# Altium project GN-1846-E-V2_HI3531A.PRJPCB (part 4 of 5)

## Sheet P05 Power Supply2.SchDoc
size 420 x 297 mm
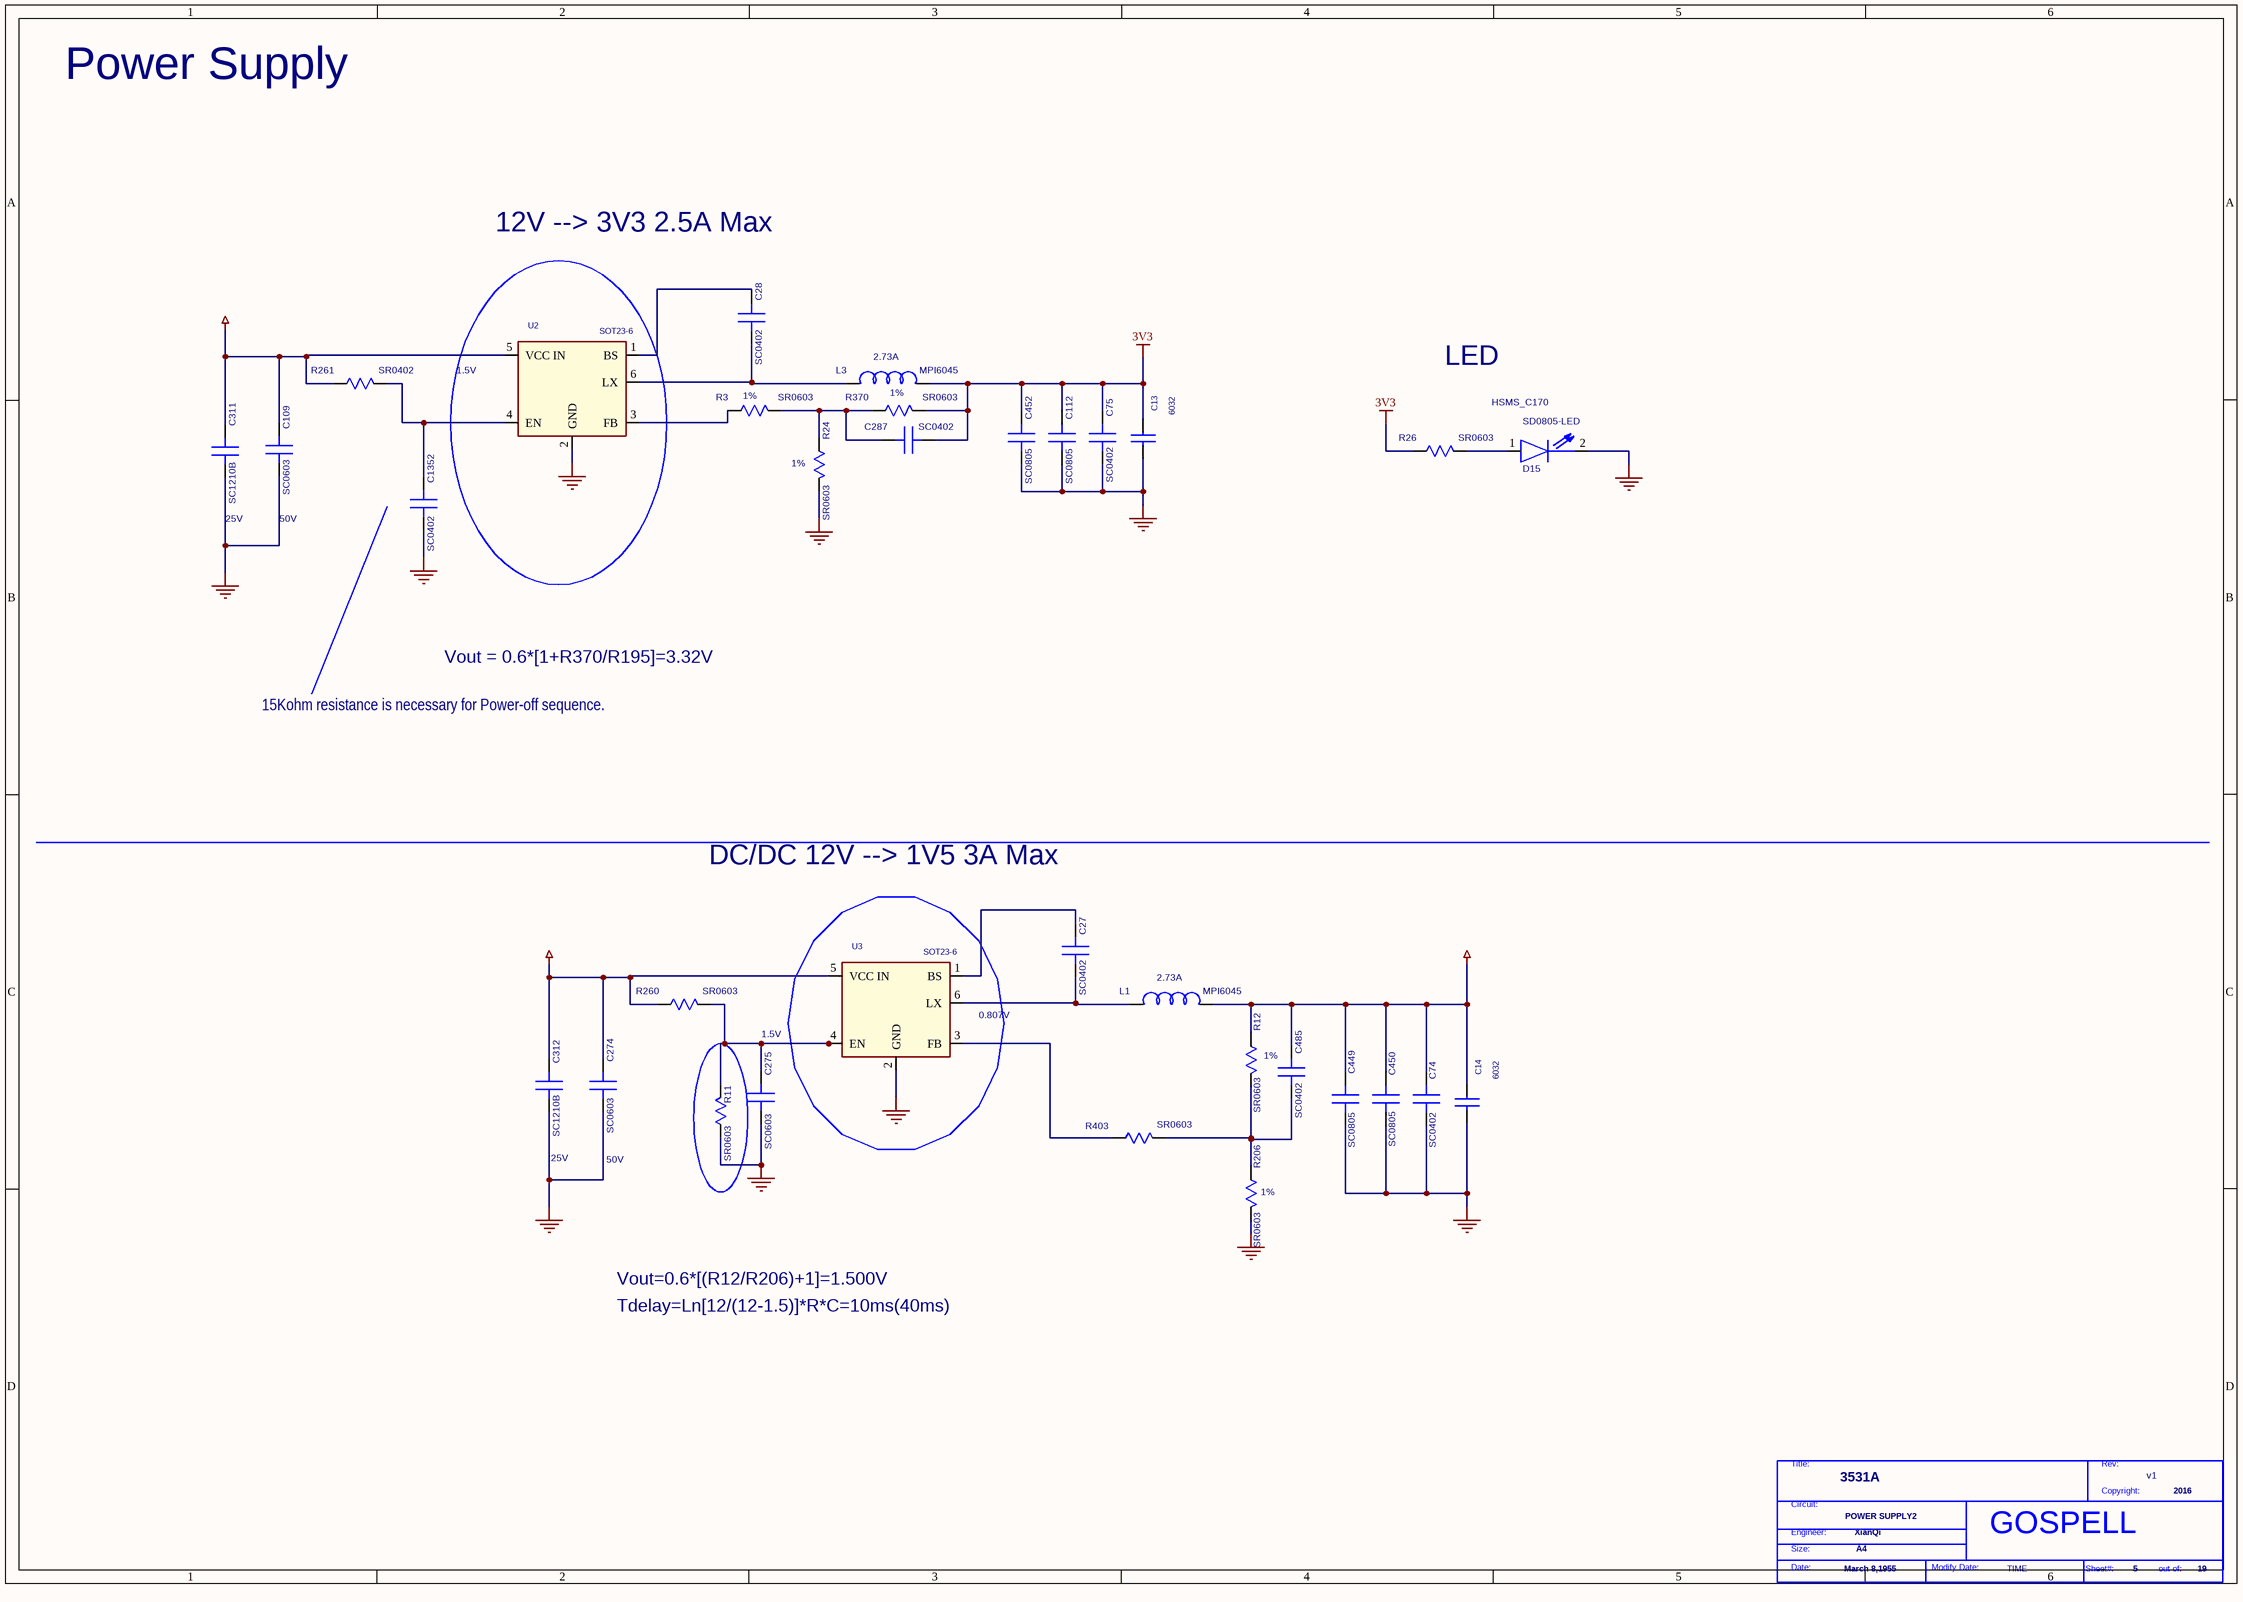
[diagram p13: P05 Power Supply2.SchDoc]

### Parts
(Parts that share a designator on the sheet are numbered #1, #2 ... from top to bottom, then left to right.)
*#14  Page Modify Date: TIME  Engineer: XianQi  Copyright: 2016  Title: 3531A  RevCode: v1  Page Size: A4  Page Create Date: March 8,1955  Page Number: 5  Page Count: 19  Doc: POWER SUPPLY2  (hidden comment: GOSPELL)  (graphical)
C13  6032  [6032]
C14  6032  [6032]
C27  SC0402  [SC0402]
C28  SC0402  [SC0402]
C74  SC0402  [SC0402]
C75  SC0402  [SC0402]
C109  SC0603  [SC0603]
C112  SC0805  [SC0805]
C274  SC0603  [SC0603]
C275  SC0603  [SC0603]
C287  SC0402  [SC0402]
C311  SC1210B  [SC1210B]
C312  SC1210B  [SC1210B]
C449  SC0805  [SC0805]
C450  SC0805  [SC0805]
C452  SC0805  [SC0805]
C485  SC0402  [SC0402]
C1352  SC0402  [SC0402]
D15  SD0805-LED  DEVICE: HSMS_C170  [SD0805-LED]
L1  MPI6045  [MPI6045]
L3  MPI6045  [MPI6045]
R3  SR0603  [SR0603]
R11  SR0603  [SR0603]
R12  SR0603  [SR0603]
R24  SR0603  [SR0603]
R26  SR0603  [SR0603]
R206  SR0603  [SR0603]
R260  SR0603  [SR0603]
R261  SR0402  [SR0402]
R370  SR0603  [SR0603]
R403  SR0603  [SR0603]
U2  SOT23-6  [SOT23-6]
U3  SOT23-6  [SOT23-6]

### Nets
1V5: C14.1 C74.1(A) C449.1(A) C450.1(A) C485.1(A) L1.2(B) R12.1(A)
3V3: C13.1 C75.1(A) C112.1(A) C287.2(B) C452.1(A) L3.2(B) R26.1(A) R370.2(B)
12V0: C109.1(A) C274.1(A) C311.1(A) C312.1(A) R260.1(A) R261.1(A) U2.5(VCC_IN) U3.5(VCC_IN)
GND: C13.2 C14.2 C74.2(B) C75.2(B) C109.2(B) C112.2(B) C274.2(B) C275.2(B) C311.2(B) C312.2(B) C449.2(B) C450.2(B) C452.2(B) C1352.2(B) D15.2(B) R11.1(A) R24.2(B) R206.2(B) U2.2(GND) U3.2(GND)
NetC27_1: C27.1(A) U3.1(BS)
NetC27_2: C27.2(B) L1.1(A) U3.6(LX)
NetC28_1: C28.1(A) U2.1(BS)
NetC28_2: C28.2(B) L3.1(A) U2.6(LX)
NetC275_1: C275.1(A) R11.2(B) R260.2(B) U3.4(EN)
NetC287_1: C287.1(A) R3.2(B) R24.1(A) R370.1(A)
NetC485_2: C485.2(B) R12.2(B) R206.1(A) R403.2(B)
NetC1352_1: C1352.1(A) R261.2(B) U2.4(EN)
NetD15_1: D15.1(A) R26.2(B)
NetR3_1: R3.1(A) U2.3(FB)
NetR403_1: R403.1(A) U3.3(FB)

### Notes on the sheet
- Power Supply
- 12V --> 3V3 2.5A Max
- (near U2) 1.5V
- (near R3) 1%
- (near L3) 2.73A
- 1%
- LED
- 25V
- 50V
- (near R24) 1%
- Vout = 0.6*[1+R370/R195]=3.32V
- 15Kohm resistance is necessary for Power-off sequence.
- DC/DC 12V --> 1V5 3A Max
- (near L1) 2.73A
- 1.5V
- (near U3) 0.807V
- (near R206) 1%
- Tdelay=Ln[12/(12-1.5)]*R*C=10ms(40ms)
- Vout=0.6*[(R12/R206)+1]=1.500V
- (in symbol GOSPELL) Title:; Rev:; Copyright:; Circuit:; Engineer:; Size:; Date:; Modify Date:; Sheet#:; out of:

### Library data of the parts
C13 C14 = CAP NP
C27 C28 = C_0_Dup2: PARTS: 1; PINSWAP: (A,B); LEVEL: STD; DEVICE: RMEMK105BJ104KV_FR; OriginalSymbolOrigin: (0,30); CODE: 8070614; %195%%232%%202%%246%: SMD陶瓷电容-16V-100NF-+/-10%-X7R-0402-BT; %182%%238%%182%%168%%185%%164%%215%%247%%181%%231%%209%%185%(V): 16; COMPONENT_HIGH_MAX: 0.55MM; %208%%161%%192%%224%%195%%251%%179%%198%: SMD陶瓷电容; PKG_TYPE: SC0402
C74 = C_0_Dup2: PARTS: 1; PINSWAP: (A,B); LEVEL: STD; DEVICE: RMEMK105BJ104KV_FR; OriginalSymbolOrigin: (0,30); %208%%161%%192%%224%%195%%251%%179%%198%: SMD陶瓷电容; COMPONENT_HIGH_MAX: 0.6MM; %182%%238%%182%%168%%185%%164%%215%%247%%181%%231%%209%%185%(V): 16; %195%%232%%202%%246%: SMD陶瓷电容-16V-100NF-+/-10%-X7R-0402-BT; CODE: 8070614; PKG_TYPE: SC0402
C75 = C_0_Dup2: PARTS: 1; PINSWAP: (A,B); LEVEL: STD; DEVICE: RMEMK105BJ104KV_FR; OriginalSymbolOrigin: (0,30); CODE: 8070614; %195%%232%%202%%246%: SMD陶瓷电容-16V-100NF-+/-10%-X7R-0402-BT; %182%%238%%182%%168%%185%%164%%215%%247%%181%%231%%209%%185%(V): 16; COMPONENT_HIGH_MAX: 0.6MM; %208%%161%%192%%224%%195%%251%%179%%198%: SMD陶瓷电容; PKG_TYPE: SC0402
C109 C274 = C_0_Dup2: PARTS: 1; PINSWAP: (A,B); LEVEL: STD; DEVICE: C1608X7R1H104KT000N; OriginalSymbolOrigin: (0,30); %208%%161%%192%%224%%195%%251%%179%%198%: SMD陶瓷电容; COMPONENT_HIGH_MAX: 0.9MM; %182%%238%%182%%168%%185%%164%%215%%247%%181%%231%%209%%185%(V): 50; %195%%232%%202%%246%: SMD陶瓷电容-50V-100NF-+/-10%-X7R-0603; CODE: 8070627; PKG_TYPE: SC0603
C112 C449 C450 = C_0_Dup2: PARTS: 1; PINSWAP: (A,B); LEVEL: STD; DEVICE: C2012X5R0J226MT000N; OriginalSymbolOrigin: (0,30); %208%%161%%192%%224%%195%%251%%179%%198%: SMD陶瓷电容; COMPONENT_HIGH_MAX: 1.35MM; %182%%238%%182%%168%%185%%164%%215%%247%%181%%231%%209%%185%(V): 6.3; %195%%232%%202%%246%: SMD陶瓷电容-6.3V-22000NF-+/-20%-X5R-0805-08070784编码拆分供华为技术使用; CODE: 8071114; PKG_TYPE: SC0805
C275 = C_0_Dup2: PARTS: 1; PINSWAP: (A,B); LEVEL: STD; DEVICE: CV05X5R105K10AH; OriginalSymbolOrigin: (0,30); %208%%161%%192%%224%%195%%251%%179%%198%: SMD陶瓷电容; COMPONENT_HIGH_MAX: 0.55MM; %182%%238%%182%%168%%185%%164%%215%%247%%181%%231%%209%%185%(V): 10; %195%%232%%202%%246%: SMD陶瓷电容-10V-1000NF-+/-10%-X5R-0402-BT,TS16949; CODE: 8070612; PKG_TYPE: SC0603
C287 = C_0_Dup2: PARTS: 1; PINSWAP: (A,B); LEVEL: STD; DEVICE: C0402C150J5GAC_7867; OriginalSymbolOrigin: (0,30); CODE: 8070544; %195%%232%%202%%246%: SMD陶瓷电容-50V-0.015NF-+/-5%-NP0-0402; %182%%238%%182%%168%%185%%164%%215%%247%%181%%231%%209%%185%(V): 50; COMPONENT_HIGH_MAX: 0.55MM; %208%%161%%192%%224%%195%%251%%179%%198%: SMD陶瓷电容; PKG_TYPE: SC0402
C311 = C_0_Dup2: PARTS: 1; PINSWAP: (A,B); LEVEL: STD; DEVICE: CETMK325B7226KM_T; OriginalSymbolOrigin: (0,30); %208%%161%%192%%224%%195%%251%%179%%198%: SMD陶瓷电容; COMPONENT_HIGH_MAX: 2.7MM; %182%%238%%182%%168%%185%%164%%215%%247%%181%%231%%209%%185%(V): 25; %195%%232%%202%%246%: SMD陶瓷电容-25V-22000NF-+/-10%-X7R-1210-所有; CODE: 8070825; PKG_TYPE: SC1210B
C312 = C_0_Dup2: PARTS: 1; PINSWAP: (A,B); LEVEL: STD; DEVICE: CETMK325B7226KM_T; OriginalSymbolOrigin: (0,30); CODE: 8070825; %195%%232%%202%%246%: SMD陶瓷电容-25V-22000NF-+/-10%-X7R-1210-所有; %182%%238%%182%%168%%185%%164%%215%%247%%181%%231%%209%%185%(V): 25; COMPONENT_HIGH_MAX: 2.7MM; %208%%161%%192%%224%%195%%251%%179%%198%: SMD陶瓷电容; PKG_TYPE: SC1210B
C452 = C_0_Dup2: PARTS: 1; PINSWAP: (A,B); LEVEL: STD; DEVICE: C2012X5R0J226MT000N; OriginalSymbolOrigin: (0,30); CODE: 8071114; %195%%232%%202%%246%: SMD陶瓷电容-6.3V-22000NF-+/-20%-X5R-0805-08070784编码拆分供华为技术使用; %182%%238%%182%%168%%185%%164%%215%%247%%181%%231%%209%%185%(V): 6.3; COMPONENT_HIGH_MAX: 1.35MM; %208%%161%%192%%224%%195%%251%%179%%198%: SMD陶瓷电容; PKG_TYPE: SC0805
C485 = C_0_Dup2: PARTS: 1; PINSWAP: (A,B); LEVEL: STD; DEVICE: C0402C150J5GAC_7867; OriginalSymbolOrigin: (0,30); %208%%161%%192%%224%%195%%251%%179%%198%: SMD陶瓷电容; COMPONENT_HIGH_MAX: 0.55MM; %182%%238%%182%%168%%185%%164%%215%%247%%181%%231%%209%%185%(V): 50; %195%%232%%202%%246%: SMD陶瓷电容-50V-0.015NF-+/-5%-NP0-0402; CODE: 8070544; PKG_TYPE: SC0402
C1352 = C_0_Dup2: PARTS: 1; PINSWAP: (A,B); LEVEL: STD; DEVICE: RK73B1ETTP273J; OriginalSymbolOrigin: (0,30); %208%%161%%192%%224%%195%%251%%179%%198%: 片式厚膜电阻器; COMPONENT_HIGH_MAX: 0.4MM; %182%%238%%182%%168%%185%%164%%215%%247%%181%%231%%209%%185%(V): 10; %195%%232%%202%%246%: 片式厚膜电阻器-0.0625W-27000OHM-+/-5%-0402; CODE: 07090852; PKG_TYPE: SC0402
D15 = LED_1: PARTS: 1; LEVEL: STD; CODE: 15020062; OriginalSymbolOrigin: (10,20); %195%%232%%202%%246%: 发光二极管-0.015CD-红色/630NM-15MA-0805; COMPONENT_HIGH_MAX: 1.1MM; %208%%161%%192%%224%%195%%251%%179%%198%: 发光二极管; PKG_TYPE: SD0805-LED
L1 L3 = L_0_Dup1: PARTS: 1; DEVICE: LMNRS5040T4R7NMGK; LEVEL: STD; PKG_TYPE: SPL0505H; OriginalSymbolOrigin: (20,20); COMPONENT_HIGH_MAX: 4.1MM; %195%%232%%202%%246%: 功率电感-4.7UH-+/-30%-2.73A-0.039OHM-5.0*5.0*4.1MM-SMT-3.18A-00821851; CODE: 10100577
R3 = R_1: PARTS: 1; LEVEL: STD; DEVICE: RK73H1JTTD3012F; PINSWAP: (A,B); OriginalSymbolOrigin: (10,20); %208%%161%%192%%224%%195%%251%%179%%198%: 片式厚膜电阻器; COMPONENT_HIGH_MAX: 0.55MM; %215%%232%%214%%181%%212%%202%%208%%237%%198%%171%%178%%238%: +/-1%; %182%%238%%182%%168%%185%%166%%194%%202%(W): 0.1; %195%%232%%202%%246%: 片式厚膜电阻器-0.1W-30100OHM-+/-1%-0603; CODE: 7090531; PKG_TYPE: SR0603
R11 = R_1: PARTS: 1; LEVEL: STD; DEVICE: RC_02W3923FT; PINSWAP: (A,B); OriginalSymbolOrigin: (10,20); CODE: 7091395; %195%%232%%202%%246%: 片式厚膜电阻器-0.0625W-392000OHM-+/-1%-0402; %182%%238%%182%%168%%185%%166%%194%%202%(W): 0.06; %215%%232%%214%%181%%212%%202%%208%%237%%198%%171%%178%%238%: +/-1%; COMPONENT_HIGH_MAX: 0.4MM; %208%%161%%192%%224%%195%%251%%179%%198%: 片式厚膜电阻器; PKG_TYPE: SR0603
R12 = R_1: PARTS: 1; LEVEL: STD; DEVICE: RHS_03K2322FT; PINSWAP: (A,B); OriginalSymbolOrigin: (10,20); %208%%161%%192%%224%%195%%251%%179%%198%: 片式厚膜电阻器; COMPONENT_HIGH_MAX: 0.55MM; %215%%232%%214%%181%%212%%202%%208%%237%%198%%171%%178%%238%: +/-1%; %182%%238%%182%%168%%185%%166%%194%%202%(W): 0.1; %195%%232%%202%%246%: 片式厚膜电阻器-0.1W-23200OHM-+/-1%-0603; CODE: 7090706; PKG_TYPE: SR0603
R24 = R_1: PARTS: 1; LEVEL: STD; DEVICE: RHS_03K1802FT; PINSWAP: (A,B); OriginalSymbolOrigin: (10,20); CODE: 7090982; %195%%232%%202%%246%: 片式厚膜电阻器-0.1W-18000OHM-+/-1%-0603; %182%%238%%182%%168%%185%%166%%194%%202%(W): 0.1; %215%%232%%214%%181%%212%%202%%208%%237%%198%%171%%178%%238%: +/-1%; COMPONENT_HIGH_MAX: 0.55MM; %208%%161%%192%%224%%195%%251%%179%%198%: 片式厚膜电阻器; PKG_TYPE: SR0603
R26 = R_1: PARTS: 1; LEVEL: STD; DEVICE: RC0603FR_07499R; PINSWAP: (A,B); OriginalSymbolOrigin: (10,20); CODE: 7090676; %195%%232%%202%%246%: 片式厚膜电阻器-0.1W-499OHM-+/-1%-0603; %182%%238%%182%%168%%185%%166%%194%%202%(W): 0.1; %215%%232%%214%%181%%212%%202%%208%%237%%198%%171%%178%%238%: +/-1%; COMPONENT_HIGH_MAX: 0.55MM; %208%%161%%192%%224%%195%%251%%179%%198%: 片式厚膜电阻器; PKG_TYPE: SR0603
R206 = R_1: PARTS: 1; LEVEL: STD; DEVICE: RK73H1JTTD2702F; PINSWAP: (A,B); OriginalSymbolOrigin: (10,20); %208%%161%%192%%224%%195%%251%%179%%198%: 片式厚膜电阻器; COMPONENT_HIGH_MAX: 0.55MM; %215%%232%%214%%181%%212%%202%%208%%237%%198%%171%%178%%238%: +/-1%; %182%%238%%182%%168%%185%%166%%194%%202%(W): 0.1; %195%%232%%202%%246%: 片式厚膜电阻器-0.1W-27000OHM-+/-1%-0603; CODE: 7090937; PKG_TYPE: SR0603
R260 = R_1: PARTS: 1; LEVEL: STD; DEVICE: RC_02W3923FT; PINSWAP: (A,B); OriginalSymbolOrigin: (10,20); %208%%161%%192%%224%%195%%251%%179%%198%: 片式厚膜电阻器; COMPONENT_HIGH_MAX: 0.4MM; %215%%232%%214%%181%%212%%202%%208%%237%%198%%171%%178%%238%: +/-1%; %182%%238%%182%%168%%185%%166%%194%%202%(W): 0.06; %195%%232%%202%%246%: 片式厚膜电阻器-0.0625W-392000OHM-+/-1%-0402; CODE: 7091395; PKG_TYPE: SR0603
R261 = R_1: PARTS: 1; LEVEL: STD; DEVICE: RK73H1ETTP1003F; PINSWAP: (A,B); OriginalSymbolOrigin: (10,20); CODE: 7090875; %195%%232%%202%%246%: 片式厚膜电阻器-0.0625W-100000OHM-+/-1%-0402; %182%%238%%182%%168%%185%%166%%194%%202%(W): 0.06; %215%%232%%214%%181%%212%%202%%208%%237%%198%%171%%178%%238%: +/-1%; COMPONENT_HIGH_MAX: 0.4MM; %208%%161%%192%%224%%195%%251%%179%%198%: 片式厚膜电阻器; PKG_TYPE: SR0402
R370 = R_1: PARTS: 1; LEVEL: STD; DEVICE: RHS_03K5622FT; PINSWAP: (A,B); OriginalSymbolOrigin: (10,20); CODE: 7090933; %195%%232%%202%%246%: 片式厚膜电阻器-0.1W-56200OHM-+/-1%-0603; %182%%238%%182%%168%%185%%166%%194%%202%(W): 0.1; %215%%232%%214%%181%%212%%202%%208%%237%%198%%171%%178%%238%: +/-1%; COMPONENT_HIGH_MAX: 0.55MM; %208%%161%%192%%224%%195%%251%%179%%198%: 片式厚膜电阻器; PKG_TYPE: SR0603
R403 = R_1: PARTS: 1; LEVEL: STD; DEVICE: RK73H1JTTD7502F; PINSWAP: (A,B); OriginalSymbolOrigin: (10,20); CODE: 7091238; %195%%232%%202%%246%: 片式厚膜电阻器-0.1W-75000OHM-+/-1%-0603; %182%%238%%182%%168%%185%%166%%194%%202%(W): 0.1; %215%%232%%214%%181%%212%%202%%208%%237%%198%%171%%178%%238%: +/-1%; COMPONENT_HIGH_MAX: 0.55MM; %208%%161%%192%%224%%195%%251%%179%%198%: 片式厚膜电阻器; PKG_TYPE: SR0603
U2 U3 = SY8120

## Sheet P04 Power Supply1.SchDoc
size 420 x 297 mm
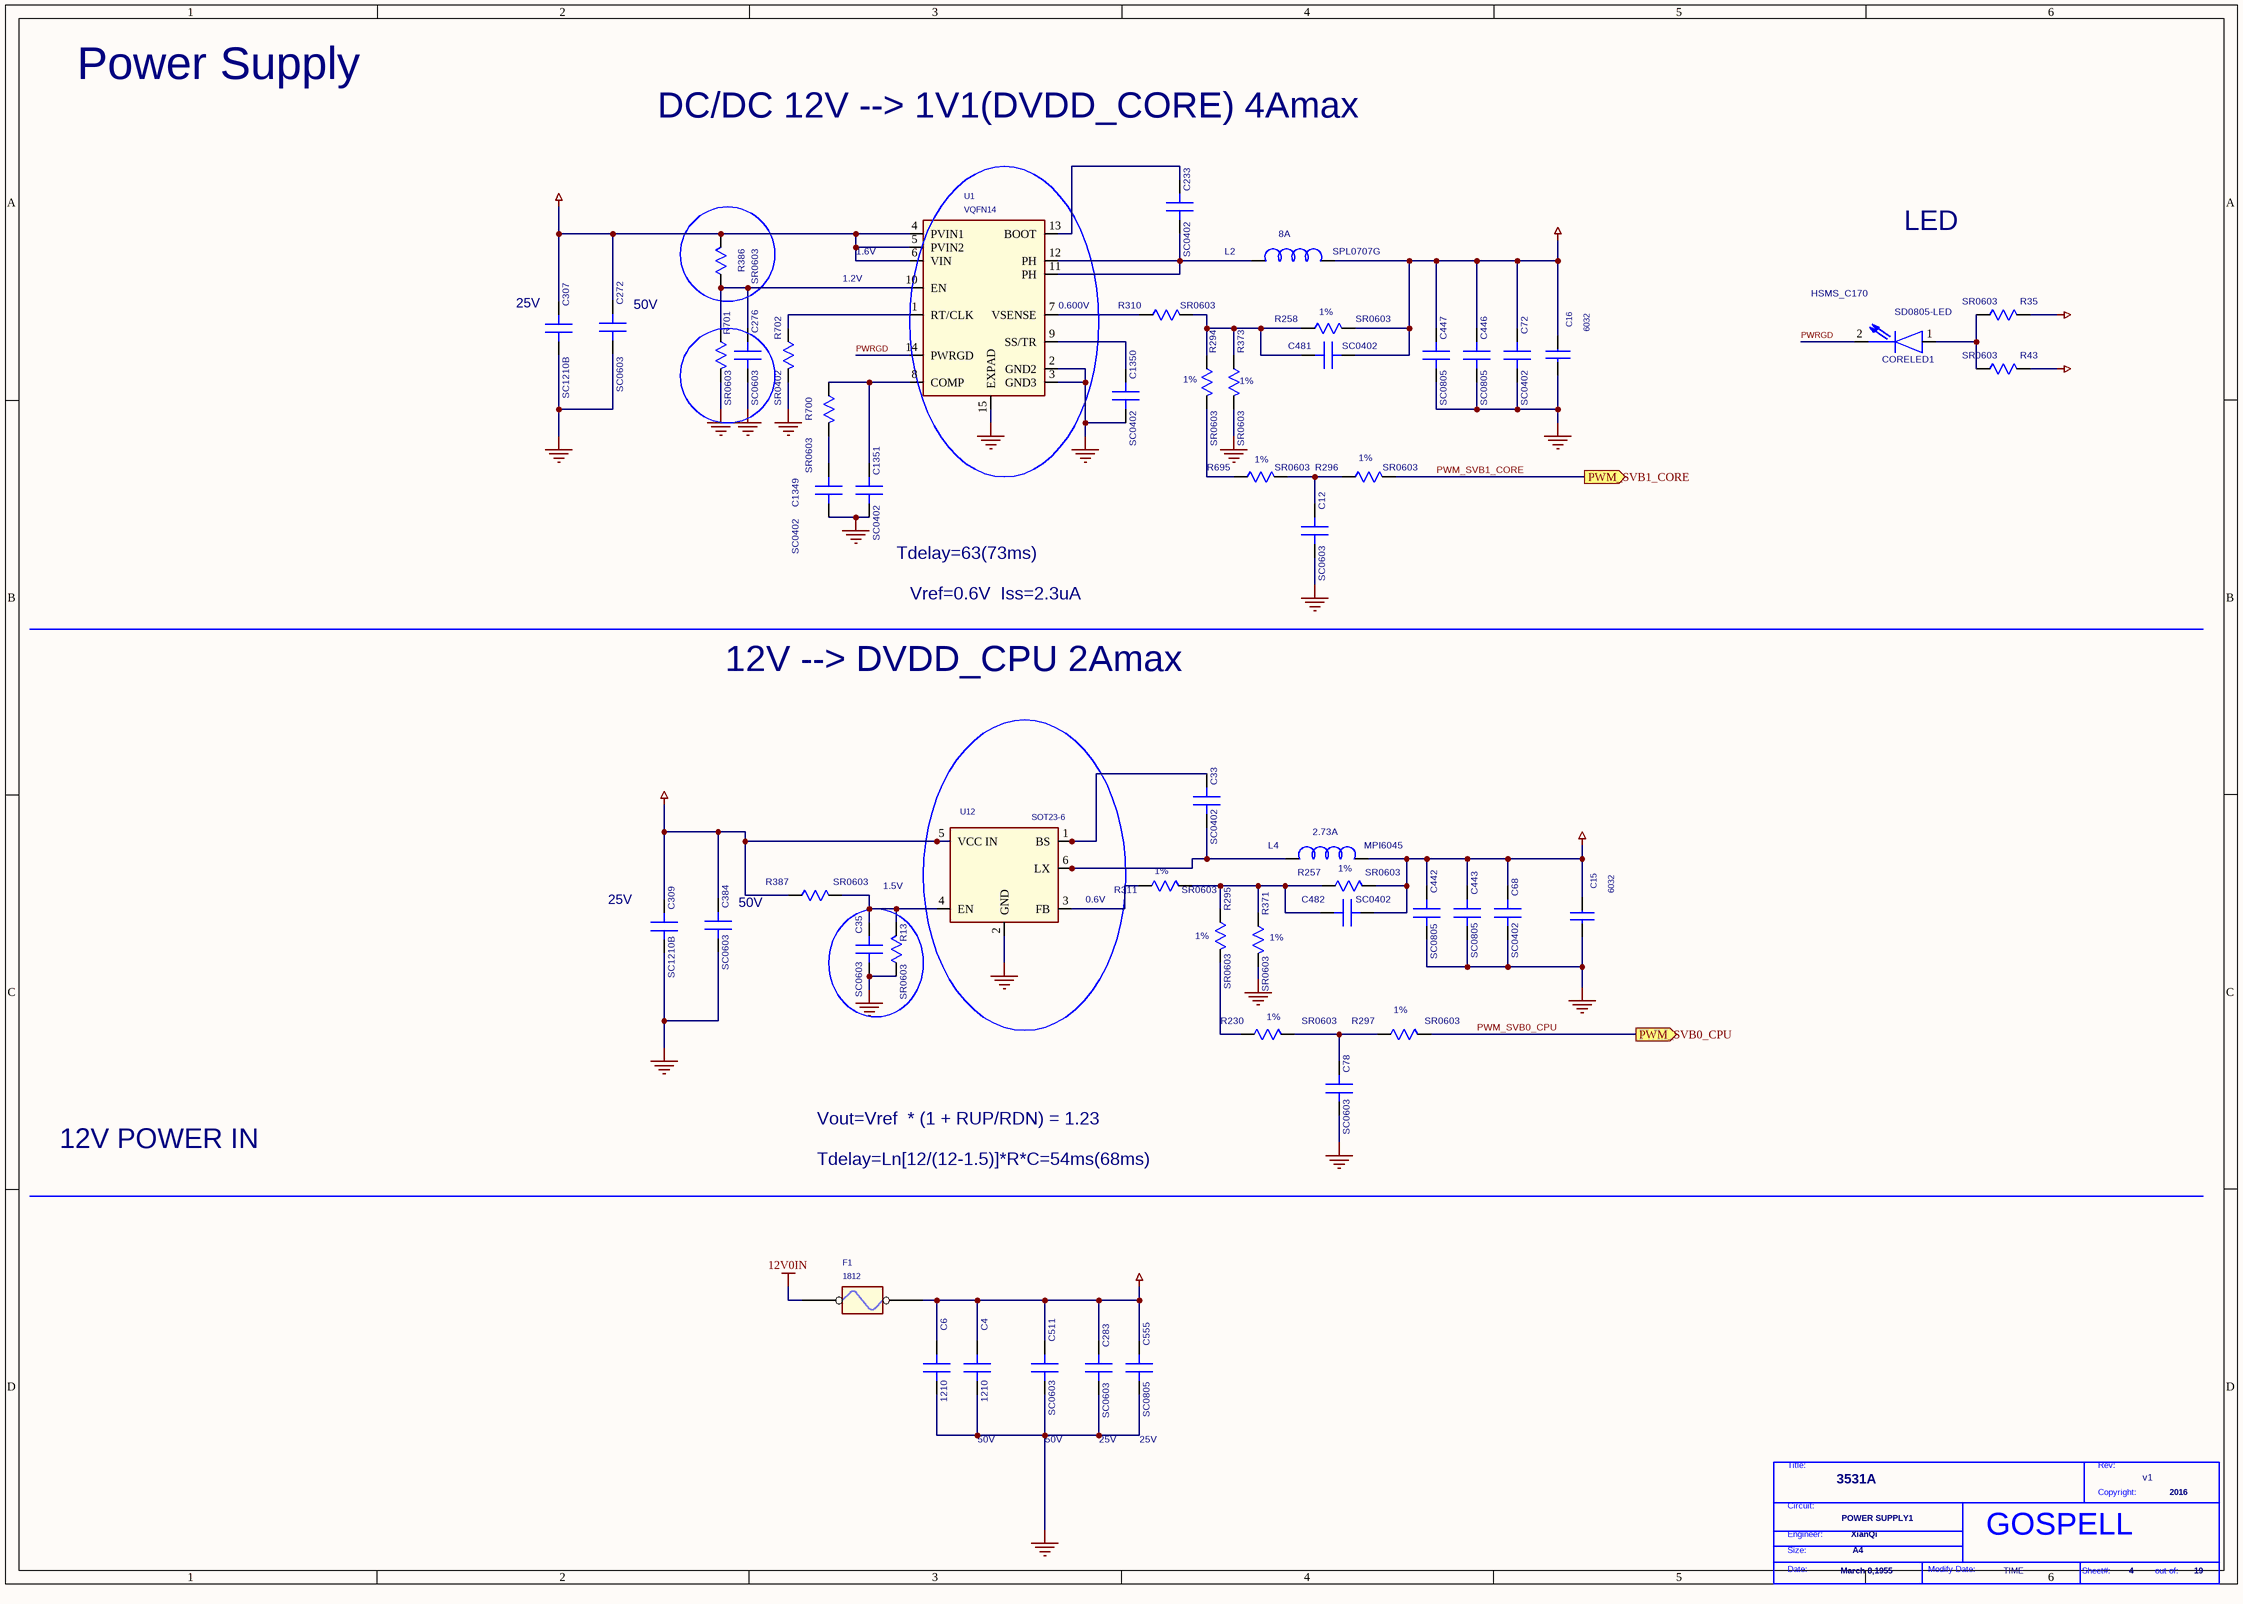
[diagram p14: P04 Power Supply1.SchDoc]

### Parts
(Parts that share a designator on the sheet are numbered #1, #2 ... from top to bottom, then left to right.)
*#15  Page Modify Date: TIME  Engineer: XianQi  Copyright: 2016  Title: 3531A  RevCode: v1  Page Size: A4  Page Create Date: March 8,1955  Page Number: 4  Page Count: 19  Doc: POWER SUPPLY1  (hidden comment: GOSPELL)  (graphical)
C4  1210  [1210]
C6  1210  [1210]
C12  SC0603  [SC0603]
C15  6032  [6032]
C16  6032  [6032]
C33  SC0402  [SC0402]
C35  SC0603  [SC0603]
C68  SC0402  [SC0402]
C72  SC0402  [SC0402]
C78  SC0603  [SC0603]
C233  SC0402  [SC0402]
C272  SC0603  [SC0603]
C276  SC0603  [SC0603]
C283  SC0603  [SC0603]
C307  SC1210B  [SC1210B]
C309  SC1210B  [SC1210B]
C384  SC0603  [SC0603]
C442  SC0805  [SC0805]
C443  SC0805  [SC0805]
C446  SC0805  [SC0805]
C447  SC0805  [SC0805]
C481  SC0402  [SC0402]
C482  SC0402  [SC0402]
C511  SC0603  [SC0603]
C555  SC0805  [SC0805]
C1349  SC0402  [SC0402]
C1350  SC0402  [SC0402]
C1351  SC0402  [SC0402]
CORELED1  SD0805-LED  DEVICE: HSMS_C170  [SD0805-LED]
F1  1812  [1812]
L2  SPL0707G  [SPL0707G]
L4  MPI6045  [MPI6045]
R13  SR0603  [SR0603]
R35  SR0603  [SR0603]
R43  SR0603  [SR0603]
R230  SR0603  [SR0603]
R257  SR0603  [SR0603]
R258  SR0603  [SR0603]
R294  SR0603  [SR0603]
R295  SR0603  [SR0603]
R296  SR0603  [SR0603]
R297  SR0603  [SR0603]
R310  SR0603  [SR0603]
R311  SR0603  [SR0603]
R371  SR0603  [SR0603]
R373  SR0603  [SR0603]
R386  SR0603  [SR0603]
R387  SR0603  [SR0603]
R695  SR0603  [SR0603]
R700  SR0603  [SR0603]
R701  SR0603  [SR0603]
R702  SR0402  [SR0402]
U1  VQFN14  [VQFN14]
U12  SOT23-6  [SOT23-6]

### Ports
PWM_SVB0_CPU (out), PWM_SVB1_CORE (out)

### Nets
3V3: R35.1(A)
12V0: C4.1(A) C6.1(A) C272.1(A) C283.1(A) C307.1(A) C309.1(A) C384.1(A) C511.1(A) C555.1(A) F1.2 R43.1(A) R386.2(B) R387.1(A) U1.4(PVIN1) U1.5(PVIN2) U1.6(VIN) U12.5(VCC_IN)
12V0IN: F1.1
DVDD_CORE: C16.1 C72.1(A) C446.1(A) C447.1(A) C481.2(B) L2.2(B) R258.2(B)
DVDD_CPU: C15.1 C68.1(A) C442.1(A) C443.1(A) C482.2(B) L4.2(B) R257.2(B)
GND: C4.2(B) C6.2(B) C12.2(B) C15.2 C16.2 C35.2(B) C68.2(B) C72.2(B) C78.2(B) C272.2(B) C276.2(B) C283.2(B) C307.2(B) C309.2(B) C384.2(B) C442.2(B) C443.2(B) C446.2(B) C447.2(B) C511.2(B) C555.2(B) C1349.2(B) C1350.2(B) C1351.2(B) R13.1(A) R371.2(B) R373.2(B) R701.2(B) R702.2(B) U1.2(GND2) U1.3(GND3) U1.15(EXPAD) U12.2(GND)
PWM_SVB0_CPU: R297.2(B) ; port PWM_SVB0_CPU
PWM_SVB1_CORE: R296.2(B) ; port PWM_SVB1_CORE
PWRGD: CORELED1.2(B) U1.14(PWRGD)
NetC12_1: C12.1(A) R296.1(A) R695.2(B)
NetC33_1: C33.1(A) U12.1(BS)
NetC33_2: C33.2(B) L4.1(A) U12.6(LX)
NetC35_1: C35.1(A) R13.2(B) R387.2(B) U12.4(EN)
NetC78_1: C78.1(A) R230.2(B) R297.1(A)
NetC233_1: C233.1(A) U1.13(BOOT)
NetC233_2: C233.2(B) L2.1(A) U1.11(PH) U1.12(PH)
NetC276_1: C276.1(A) R386.1(A) R701.1(A) U1.10(EN)
NetC481_1: C481.1(A) R258.1(A) R294.1(A) R310.2(B) R373.1(A)
NetC482_1: C482.1(A) R257.1(A) R295.1(A) R311.2(B) R371.1(A)
NetC1349_1: C1349.1(A) R700.2(B)
NetC1350_1: C1350.1(A) U1.9(SS/TR)
NetC1351_1: C1351.1(A) R700.1(A) U1.8(COMP)
NetCORELED1_1: CORELED1.1(A) R35.2(B) R43.2(B)
NetR230_1: R230.1(A) R295.2(B)
NetR294_2: R294.2(B) R695.1(A)
NetR310_1: R310.1(A) U1.7(VSENSE)
NetR311_1: R311.1(A) U12.3(FB)
NetR702_1: R702.1(A) U1.1(RT/CLK)

### Notes on the sheet
- Power Supply
- DC/DC 12V --> 1V1(DVDD_CORE) 4Amax
- (near U1) 1.6V
- (near L2) 8A
- LED
- (near C307) 25V
- (near C272) 50V
- 1.2V
- (near U1) 0.600V
- (near R258) 1%
- (near R294) 1%
- (near R373) 1%
- (near R695) 1%
- (near R296) 1%
- (near C1351) Tdelay=63(73ms)
- Vref=0.6V  Iss=2.3uA
- 12V --> DVDD_CPU 2Amax
- (near L4) 2.73A
- (near C309) 25V
- (near C384) 50V
- 1.5V
- (near U12) 0.6V
- (near R311) 1%
- (near R295) 1%
- 1%
- (near R371) 1%
- (near R230) 1%
- (near R297) 1%
- Vout=Vref  * (1 + RUP/RDN) = 1.23
- 12V POWER IN
- Tdelay=Ln[12/(12-1.5)]*R*C=54ms(68ms)
- 50V
- 25V
- (in symbol GOSPELL) Title:; Rev:; Copyright:; Circuit:; Engineer:; Size:; Date:; Modify Date:; Sheet#:; out of:

### Library data of the parts
C4 C6 = C_0_Dup2: PARTS: 1; PINSWAP: (A,B); LEVEL: STD; PKG_TYPE: SC0603; DEVICE: 06035C102KAT2A; OriginalSymbolOrigin: (0,30); %208%%161%%192%%224%%195%%251%%179%%198%: SMD陶瓷电容; COMPONENT_HIGH_MAX: 0.9MM; %182%%238%%182%%168%%185%%164%%215%%247%%181%%231%%209%%185%(V): 50; %195%%232%%202%%246%: SMD陶瓷电容-50V-1NF-±10%-X7R-0603; CODE: 8070249
C12 = C_0: PARTS: 1; OriginalSymbolOrigin: (0,30); DEVICE: GRM188R61A225KE34D; LEVEL: STD; PINSWAP: (A,B); CODE: 8070573; %195%%232%%202%%246%: SMD陶瓷电容-10V-2200NF-+/-10%-X5R-0603; %182%%238%%182%%168%%185%%164%%215%%247%%181%%231%%209%%185%(V): 10; COMPONENT_HIGH_MAX: 0.9MM; %208%%161%%192%%224%%195%%251%%179%%198%: SMD陶瓷电容; PKG_TYPE: SC0603
C15 C16 = CAP NP
C33 = C_0_Dup2: PARTS: 1; PINSWAP: (A,B); LEVEL: STD; DEVICE: RMEMK105BJ104KV_FR; OriginalSymbolOrigin: (0,30); %208%%161%%192%%224%%195%%251%%179%%198%: SMD陶瓷电容; COMPONENT_HIGH_MAX: 0.55MM; %182%%238%%182%%168%%185%%164%%215%%247%%181%%231%%209%%185%(V): 16; %195%%232%%202%%246%: SMD陶瓷电容-16V-100NF-+/-10%-X7R-0402-BT; CODE: 8070614; PKG_TYPE: SC0402
C35 = C_0_Dup2: PARTS: 1; PINSWAP: (A,B); LEVEL: STD; DEVICE: CV05X5R105K10AH; OriginalSymbolOrigin: (0,30); CODE: 8070612; %195%%232%%202%%246%: SMD陶瓷电容-10V-1000NF-+/-10%-X5R-0402-BT,TS16949; %182%%238%%182%%168%%185%%164%%215%%247%%181%%231%%209%%185%(V): 10; COMPONENT_HIGH_MAX: 0.55MM; %208%%161%%192%%224%%195%%251%%179%%198%: SMD陶瓷电容; PKG_TYPE: SC0603
C68 = C_0_Dup2: as C74 on sheet P05 Power Supply2; PKG_TYPE: SC0402
C72 = C_0: PARTS: 1; OriginalSymbolOrigin: (0,30); DEVICE: RMEMK105BJ104KV_FR; LEVEL: STD; PINSWAP: (A,B); CODE: 8070614; %195%%232%%202%%246%: SMD陶瓷电容-16V-100NF-+/-10%-X7R-0402-BT; %182%%238%%182%%168%%185%%164%%215%%247%%181%%231%%209%%185%(V): 16; COMPONENT_HIGH_MAX: 0.6MM; %208%%161%%192%%224%%195%%251%%179%%198%: SMD陶瓷电容; PKG_TYPE: SC0402
C78 = C_0_Dup2: PARTS: 1; PINSWAP: (A,B); LEVEL: STD; DEVICE: GRM188R61A225KE34D; OriginalSymbolOrigin: (0,30); %208%%161%%192%%224%%195%%251%%179%%198%: SMD陶瓷电容; COMPONENT_HIGH_MAX: 0.9MM; %182%%238%%182%%168%%185%%164%%215%%247%%181%%231%%209%%185%(V): 10; %195%%232%%202%%246%: SMD陶瓷电容-10V-2200NF-+/-10%-X5R-0603; CODE: 8070573; PKG_TYPE: SC0603
C233 = C_0: PARTS: 1; OriginalSymbolOrigin: (0,30); DEVICE: RMEMK105BJ104KV_FR; LEVEL: STD; PINSWAP: (A,B); CODE: 8070614; %195%%232%%202%%246%: SMD陶瓷电容-16V-100NF-+/-10%-X7R-0402-BT; %182%%238%%182%%168%%185%%164%%215%%247%%181%%231%%209%%185%(V): 16; COMPONENT_HIGH_MAX: 0.55MM; %208%%161%%192%%224%%195%%251%%179%%198%: SMD陶瓷电容; PKG_TYPE: SC0402
C272 = C_0: PARTS: 1; OriginalSymbolOrigin: (0,30); DEVICE: C1608X7R1H104KT000N; LEVEL: STD; PINSWAP: (A,B); %208%%161%%192%%224%%195%%251%%179%%198%: SMD陶瓷电容; COMPONENT_HIGH_MAX: 0.9MM; %182%%238%%182%%168%%185%%164%%215%%247%%181%%231%%209%%185%(V): 50; %195%%232%%202%%246%: SMD陶瓷电容-50V-100NF-+/-10%-X7R-0603; CODE: 8070627; PKG_TYPE: SC0603
C276 = C_0: PARTS: 1; OriginalSymbolOrigin: (0,30); DEVICE: GRM188R61C105KA12D; LEVEL: STD; PINSWAP: (A,B); CODE: 8070601; %195%%232%%202%%246%: SMD陶瓷电容-16V-1000NF-+/-10%-X5R-0603; %182%%238%%182%%168%%185%%164%%215%%247%%181%%231%%209%%185%(V): 16; COMPONENT_HIGH_MAX: 0.95MM; %208%%161%%192%%224%%195%%251%%179%%198%: SMD陶瓷电容; PKG_TYPE: SC0603
C283 = C_0_Dup2: PARTS: 1; PINSWAP: (A,B); LEVEL: STD; DEVICE: C1608X7R1H104KT000N; OriginalSymbolOrigin: (0,30); %208%%161%%192%%224%%195%%251%%179%%198%: SMD陶瓷电容; COMPONENT_HIGH_MAX: 0.9MM; %182%%238%%182%%168%%185%%164%%215%%247%%181%%231%%209%%185%(V): 50; %195%%232%%202%%246%: SMD陶瓷电容-50V-100NF-±10%-X7R-0603; CODE: 8070627; PKG_TYPE: SC0603
C307 = C_0: PARTS: 1; OriginalSymbolOrigin: (0,30); DEVICE: CETMK325B7226KM_T; LEVEL: STD; PINSWAP: (A,B); %208%%161%%192%%224%%195%%251%%179%%198%: SMD陶瓷电容; COMPONENT_HIGH_MAX: 2.7MM; %182%%238%%182%%168%%185%%164%%215%%247%%181%%231%%209%%185%(V): 25; %195%%232%%202%%246%: SMD陶瓷电容-25V-22000NF-+/-10%-X7R-1210-所有; CODE: 8070825; PKG_TYPE: SC1210B
C309 = C_0_Dup2: as C311 on sheet P05 Power Supply2; PKG_TYPE: SC1210B
C384 = C_0_Dup2: as C109 on sheet P05 Power Supply2; PKG_TYPE: SC0603
C442 = C_0_Dup2: as C452 on sheet P05 Power Supply2; PKG_TYPE: SC0805
C443 = C_0_Dup2: as C112 on sheet P05 Power Supply2; PKG_TYPE: SC0805
C446 = C_0: PARTS: 1; OriginalSymbolOrigin: (0,30); DEVICE: C2012X5R0J226MT000N; LEVEL: STD; PINSWAP: (A,B); CODE: 8071114; %195%%232%%202%%246%: SMD陶瓷电容-6.3V-22000NF-+/-20%-X5R-0805-08070784编码拆分供华为技术使用; %182%%238%%182%%168%%185%%164%%215%%247%%181%%231%%209%%185%(V): 6.3; COMPONENT_HIGH_MAX: 1.35MM; %208%%161%%192%%224%%195%%251%%179%%198%: SMD陶瓷电容; PKG_TYPE: SC0805
C447 = C_0: PARTS: 1; OriginalSymbolOrigin: (0,30); DEVICE: C2012X5R0J226MT000N; LEVEL: STD; PINSWAP: (A,B); %208%%161%%192%%224%%195%%251%%179%%198%: SMD陶瓷电容; COMPONENT_HIGH_MAX: 1.35MM; %182%%238%%182%%168%%185%%164%%215%%247%%181%%231%%209%%185%(V): 6.3; %195%%232%%202%%246%: SMD陶瓷电容-6.3V-22000NF-+/-20%-X5R-0805-08070784编码拆分供华为技术使用; CODE: 8071114; PKG_TYPE: SC0805
C481 = C_0: PARTS: 1; OriginalSymbolOrigin: (0,30); DEVICE: 04025A100JAT2A; LEVEL: STD; PINSWAP: (A,B); %208%%161%%192%%224%%195%%251%%179%%198%: SMD陶瓷电容; COMPONENT_HIGH_MAX: 0.56MM; %182%%238%%182%%168%%185%%164%%215%%247%%181%%231%%209%%185%(V): 50; %195%%232%%202%%246%: SMD陶瓷电容-50V-0.01NF-+/-5%-NP0-0402-BT; CODE: 8070530; PKG_TYPE: SC0402
C482 = C_0_Dup2: as C485 on sheet P05 Power Supply2; PKG_TYPE: SC0402
C511 = C_0_Dup2: PARTS: 1; PINSWAP: (A,B); LEVEL: STD; DEVICE: 06035C102KAT2A; OriginalSymbolOrigin: (0,30); CODE: 8070249; %195%%232%%202%%246%: SMD陶瓷电容-50V-1NF-±10%-X7R-0603; %182%%238%%182%%168%%185%%164%%215%%247%%181%%231%%209%%185%(V): 50; COMPONENT_HIGH_MAX: 0.9MM; %208%%161%%192%%224%%195%%251%%179%%198%: SMD陶瓷电容; PKG_TYPE: SC0603
C555 = C_0_Dup2: PARTS: 1; PINSWAP: (A,B); LEVEL: STD; DEVICE: C2012X5R1E106KT000N1; OriginalSymbolOrigin: (0,30); CODE: 8071629; %195%%232%%202%%246%: SMD陶瓷电容-25V-10000NF-+/-20%-X5R-0805; %182%%238%%182%%168%%185%%164%%215%%247%%181%%231%%209%%185%(V): 25; COMPONENT_HIGH_MAX: 1.45MM; %208%%161%%192%%224%%195%%251%%179%%198%: SMD陶瓷电容; PKG_TYPE: SC0805
C1349 = C_0: PARTS: 1; OriginalSymbolOrigin: (0,30); DEVICE: RMEMK105BJ104KV_FR; LEVEL: STD; PINSWAP: (A,B); %208%%161%%192%%224%%195%%251%%179%%198%: SMD陶瓷电容; COMPONENT_HIGH_MAX: 0.55MM; %182%%238%%182%%168%%185%%164%%215%%247%%181%%231%%209%%185%(V): 16; %195%%232%%202%%246%: SMD陶瓷电容-16V-100NF-+/-10%-X7R-0402-BT; CODE: 8070614; PKG_TYPE: SC0402
C1350 = C_0: PARTS: 1; OriginalSymbolOrigin: (0,30); DEVICE: C1005X7R1E153KT000F_A; LEVEL: STD; PINSWAP: (A,B); %208%%161%%192%%224%%195%%251%%179%%198%: SMD陶瓷电容; COMPONENT_HIGH_MAX: 0.55MM; %182%%238%%182%%168%%185%%164%%215%%247%%181%%231%%209%%185%(V): 25; %195%%232%%202%%246%: SMD陶瓷电容-25V-15NF-+/-10%-X7R-0402-所有; CODE: 8070847; PKG_TYPE: SC0402
C1351 = C_0: PARTS: 1; OriginalSymbolOrigin: (0,30); DEVICE: CV05X5R105K10AH; LEVEL: STD; PINSWAP: (A,B); %208%%161%%192%%224%%195%%251%%179%%198%: SMD陶瓷电容; COMPONENT_HIGH_MAX: 0.55MM; %182%%238%%182%%168%%185%%164%%215%%247%%181%%231%%209%%185%(V): 10; %195%%232%%202%%246%: SMD陶瓷电容-10V-1000NF-+/-10%-X5R-0402-BT,TS16949; CODE: 8070612; PKG_TYPE: SC0402
CORELED1 = LED_1: PARTS: 1; LEVEL: STD; CODE: 15020062; OriginalSymbolOrigin: (10,20); %208%%161%%192%%224%%195%%251%%179%%198%: 发光二极管; COMPONENT_HIGH_MAX: 1.1MM; %195%%232%%202%%246%: 发光二极管-0.015CD-红色/630NM-15MA-0805; PKG_TYPE: SD0805-LED
F1 = FUSEHOLDER
L2 = L_0: PARTS: 1; OriginalSymbolOrigin: (20,20); LEVEL: STD; DEVICE: LQCHATS2R2M30K; %208%%161%%192%%224%%195%%251%%179%%198%: 贴片电感器; COMPONENT_HIGH_MAX: 3MM; %195%%232%%202%%246%: 贴片电感器-2.2UH-+-20%-0.019OHM-8A-45°-6.95*6.6*2.8MM; CODE: 10031418; PKG_TYPE: SPL0707G
L4 = L_0_Dup1: PARTS: 1; DEVICE: LMNRS5040T4R7NMGK; LEVEL: STD; PKG_TYPE: SPL0505H; OriginalSymbolOrigin: (20,20); CODE: 10100577; %195%%232%%202%%246%: 功率电感-4.7UH-+/-30%-2.73A-0.039OHM-5.0*5.0*4.1MM-SMT-3.18A-00821851; COMPONENT_HIGH_MAX: 4.1MM
R13 = R_1: as R260 on sheet P05 Power Supply2; PKG_TYPE: SR0603
R35 = R_1: as R26 on sheet P05 Power Supply2; PKG_TYPE: SR0603
R43 = R_1: PARTS: 1; LEVEL: STD; DEVICE: RC0603FR_07499R; PINSWAP: (A,B); OriginalSymbolOrigin: (10,20); %208%%161%%192%%224%%195%%251%%179%%198%: 片式厚膜电阻器; COMPONENT_HIGH_MAX: 0.55MM; %215%%232%%214%%181%%212%%202%%208%%237%%198%%171%%178%%238%: +/-1%; %182%%238%%182%%168%%185%%166%%194%%202%(W): 0.1; %195%%232%%202%%246%: 片式厚膜电阻器-0.1W-499OHM-+/-1%-0603; CODE: 7090676; PKG_TYPE: SR0603
R230 = R_1: PARTS: 1; LEVEL: STD; DEVICE: RHS_03K6982FT; PINSWAP: (A,B); OriginalSymbolOrigin: (10,20); CODE: 7090751; %195%%232%%202%%246%: 片式厚膜电阻器-0.1W-69800OHM-+/-1%-0603; %182%%238%%182%%168%%185%%166%%194%%202%(W): 0.1; %215%%232%%214%%181%%212%%202%%208%%237%%198%%171%%178%%238%: +/-1%; COMPONENT_HIGH_MAX: 0.55MM; %208%%161%%192%%224%%195%%251%%179%%198%: 片式厚膜电阻器; PKG_TYPE: SR0603
R257 = R_1: PARTS: 1; LEVEL: STD; DEVICE: RC0603FR_0714K3; PINSWAP: (A,B); OriginalSymbolOrigin: (10,20); %208%%161%%192%%224%%195%%251%%179%%198%: 片式厚膜电阻器; COMPONENT_HIGH_MAX: 0.55MM; %215%%232%%214%%181%%212%%202%%208%%237%%198%%171%%178%%238%: +/-1%; %182%%238%%182%%168%%185%%166%%194%%202%(W): 0.1; %195%%232%%202%%246%: 片式厚膜电阻器-0.1W-14300OHM-+/-1%-0603; CODE: 7090775; PKG_TYPE: SR0603
R258 = R_0: PARTS: 1; OriginalSymbolOrigin: (10,20); PINSWAP: (A,B); DEVICE: RHS_03K1802FT; LEVEL: STD; CODE: 7090982; %195%%232%%202%%246%: 片式厚膜电阻器-0.1W-18000OHM-+/-1%-0603; %182%%238%%182%%168%%185%%166%%194%%202%(W): 0.1; %215%%232%%214%%181%%212%%202%%208%%237%%198%%171%%178%%238%: +/-1%; COMPONENT_HIGH_MAX: 0.55MM; %208%%161%%192%%224%%195%%251%%179%%198%: 片式厚膜电阻器; PKG_TYPE: SR0603
R294 = R_0: PARTS: 1; OriginalSymbolOrigin: (10,20); PINSWAP: (A,B); DEVICE: RK73H1JTTD2702F; LEVEL: STD; %208%%161%%192%%224%%195%%251%%179%%198%: 片式厚膜电阻器; COMPONENT_HIGH_MAX: 0.55MM; %215%%232%%214%%181%%212%%202%%208%%237%%198%%171%%178%%238%: +/-1%; %182%%238%%182%%168%%185%%166%%194%%202%(W): 0.1; %195%%232%%202%%246%: 片式厚膜电阻器-0.1W-27000OHM-+/-1%-0603; CODE: 7090937; PKG_TYPE: SR0603
R295 = R_1: PARTS: 1; LEVEL: STD; DEVICE: RC0603FR_0759K; PINSWAP: (A,B); OriginalSymbolOrigin: (10,20); CODE: 7090739; %195%%232%%202%%246%: 片式厚膜电阻器-0.1W-59000OHM-+/-1%-0603; %182%%238%%182%%168%%185%%166%%194%%202%(W): 0.1; %215%%232%%214%%181%%212%%202%%208%%237%%198%%171%%178%%238%: +/-1%; COMPONENT_HIGH_MAX: 0.55MM; %208%%161%%192%%224%%195%%251%%179%%198%: 片式厚膜电阻器; PKG_TYPE: SR0603
R296 = R_0: PARTS: 1; OriginalSymbolOrigin: (10,20); PINSWAP: (A,B); DEVICE: RK73H1JTTD1001F; LEVEL: STD; CODE: 7090885; %195%%232%%202%%246%: 片式厚膜电阻器-0.1W-1000OHM-+/-1%-0603; %182%%238%%182%%168%%185%%166%%194%%202%(W): 0.1; %215%%232%%214%%181%%212%%202%%208%%237%%198%%171%%178%%238%: +/-1%; COMPONENT_HIGH_MAX: 0.55MM; %208%%161%%192%%224%%195%%251%%179%%198%: 片式厚膜电阻器; PKG_TYPE: SR0603
R297 = R_1: PARTS: 1; LEVEL: STD; DEVICE: RK73H1JTTD1001F; PINSWAP: (A,B); OriginalSymbolOrigin: (10,20); %208%%161%%192%%224%%195%%251%%179%%198%: 片式厚膜电阻器; COMPONENT_HIGH_MAX: 0.55MM; %215%%232%%214%%181%%212%%202%%208%%237%%198%%171%%178%%238%: +/-1%; %182%%238%%182%%168%%185%%166%%194%%202%(W): 0.1; %195%%232%%202%%246%: 片式厚膜电阻器-0.1W-1000OHM-+/-1%-0603; CODE: 7090885; PKG_TYPE: SR0603
R310 = R_0: PARTS: 1; OriginalSymbolOrigin: (10,20); PINSWAP: (A,B); DEVICE: RC0603JR_070RL; LEVEL: STD; %208%%161%%192%%224%%195%%251%%179%%198%: 片式厚膜电阻器; COMPONENT_HIGH_MAX: 0.6MM; %215%%232%%214%%181%%212%%202%%208%%237%%198%%171%%178%%238%: <50MOHM; %182%%238%%182%%168%%185%%166%%194%%202%(W): 0.1; %195%%232%%202%%246%: 片式厚膜电阻器-0.1W-0OHM-<50MOHM-0603-1A-BT,TS16949; CODE: 7090522; PKG_TYPE: SR0603
R311 = R_1: PARTS: 1; LEVEL: STD; DEVICE: RC0603FR_0782K5; PINSWAP: (A,B); OriginalSymbolOrigin: (10,20); %208%%161%%192%%224%%195%%251%%179%%198%: 片式厚膜电阻器; COMPONENT_HIGH_MAX: 0.55MM; %215%%232%%214%%181%%212%%202%%208%%237%%198%%171%%178%%238%: +/-1%; %182%%238%%182%%168%%185%%166%%194%%202%(W): 0.1; %195%%232%%202%%246%: 片式厚膜电阻器-0.1W-82500OHM-+/-1%-0603; CODE: 7090737; PKG_TYPE: SR0603
R371 = R_1: PARTS: 1; LEVEL: STD; DEVICE: RK73H1JTTD2702F; PINSWAP: (A,B); OriginalSymbolOrigin: (10,20); CODE: 7090937; %195%%232%%202%%246%: 片式厚膜电阻器-0.1W-27000OHM-+/-1%-0603; %182%%238%%182%%168%%185%%166%%194%%202%(W): 0.1; %215%%232%%214%%181%%212%%202%%208%%237%%198%%171%%178%%238%: +/-1%; COMPONENT_HIGH_MAX: 0.55MM; %208%%161%%192%%224%%195%%251%%179%%198%: 片式厚膜电阻器; PKG_TYPE: SR0603
R373 = R_0: PARTS: 1; OriginalSymbolOrigin: (10,20); PINSWAP: (A,B); DEVICE: RC0603FR_0719K6; LEVEL: STD; %208%%161%%192%%224%%195%%251%%179%%198%: 片式厚膜电阻器; COMPONENT_HIGH_MAX: 0.55MM; %215%%232%%214%%181%%212%%202%%208%%237%%198%%171%%178%%238%: +/-1%; %182%%238%%182%%168%%185%%166%%194%%202%(W): 0.1; %195%%232%%202%%246%: 片式厚膜电阻器-0.1W-19600OHM-+/-1%-0603; CODE: 7090707; PKG_TYPE: SR0603
R386 = R_0: PARTS: 1; OriginalSymbolOrigin: (10,20); PINSWAP: (A,B); DEVICE: RC0603JR_07510KL; LEVEL: STD; CODE: 7090648; %195%%232%%202%%246%: 片式厚膜电阻器-0.1W-510000OHM-+/-5%-0603; %182%%238%%182%%168%%185%%166%%194%%202%(W): 0.1; %215%%232%%214%%181%%212%%202%%208%%237%%198%%171%%178%%238%: +/-5%; COMPONENT_HIGH_MAX: 0.55MM; %208%%161%%192%%224%%195%%251%%179%%198%: 片式厚膜电阻器; PKG_TYPE: SR0603
R387 = R_1: PARTS: 1; LEVEL: STD; DEVICE: RC_02W6813FT; PINSWAP: (A,B); OriginalSymbolOrigin: (10,20); %208%%161%%192%%224%%195%%251%%179%%198%: 片式厚膜电阻器; COMPONENT_HIGH_MAX: 0.4MM; %215%%232%%214%%181%%212%%202%%208%%237%%198%%171%%178%%238%: +/-1%; %182%%238%%182%%168%%185%%166%%194%%202%(W): 0.06; %195%%232%%202%%246%: 片式厚膜电阻器-0.0625W-681000OHM-+/-1%-0402; CODE: 7091399; PKG_TYPE: SR0603
R695 = R_0: PARTS: 1; OriginalSymbolOrigin: (10,20); PINSWAP: (A,B); DEVICE: RK73H1JTTD1503F; LEVEL: STD; CODE: 7091239; %195%%232%%202%%246%: 片式厚膜电阻器-0.1W-150000OHM-+/-1%-0603; %182%%238%%182%%168%%185%%166%%194%%202%(W): 0.1; %215%%232%%214%%181%%212%%202%%208%%237%%198%%171%%178%%238%: +/-1%; COMPONENT_HIGH_MAX: 0.55MM; %208%%161%%192%%224%%195%%251%%179%%198%: 片式厚膜电阻器; PKG_TYPE: SR0603
R700 = R_0: PARTS: 1; OriginalSymbolOrigin: (10,20); PINSWAP: (A,B); DEVICE: RC0603FR_07143K; LEVEL: STD; CODE: 7090745; %195%%232%%202%%246%: 片式厚膜电阻器-0.1W-143000OHM-+/-1%-0603; %182%%238%%182%%168%%185%%166%%194%%202%(W): 0.1; %215%%232%%214%%181%%212%%202%%208%%237%%198%%171%%178%%238%: +/-1%; COMPONENT_HIGH_MAX: 0.55MM; %208%%161%%192%%224%%195%%251%%179%%198%: 片式厚膜电阻器; PKG_TYPE: SR0603
R701 = R_0: PARTS: 1; OriginalSymbolOrigin: (10,20); PINSWAP: (A,B); DEVICE: RK73H1JTTD1503F; LEVEL: STD; %208%%161%%192%%224%%195%%251%%179%%198%: 片式厚膜电阻器; COMPONENT_HIGH_MAX: 0.55MM; %215%%232%%214%%181%%212%%202%%208%%237%%198%%171%%178%%238%: +/-1%; %182%%238%%182%%168%%185%%166%%194%%202%(W): 0.1; %195%%232%%202%%246%: 片式厚膜电阻器-0.1W-150000OHM-+/-1%-0603; CODE: 7091239; PKG_TYPE: SR0603
R702 = R_0: PARTS: 1; OriginalSymbolOrigin: (10,20); PINSWAP: (A,B); DEVICE: RK73H1ETTP1003F; LEVEL: STD; CODE: 7090875; %195%%232%%202%%246%: 片式厚膜电阻器-0.0625W-100000OHM-+/-1%-0402; %182%%238%%182%%168%%185%%166%%194%%202%(W): 0.06; %215%%232%%214%%181%%212%%202%%208%%237%%198%%171%%178%%238%: +/-1%; COMPONENT_HIGH_MAX: 0.4MM; %208%%161%%192%%224%%195%%251%%179%%198%: 片式厚膜电阻器; PKG_TYPE: SR0402
U1 = TPS54821
U12 = SY8120

## Sheet P03 POWER TREE.SchDoc
size 297 x 209 mm
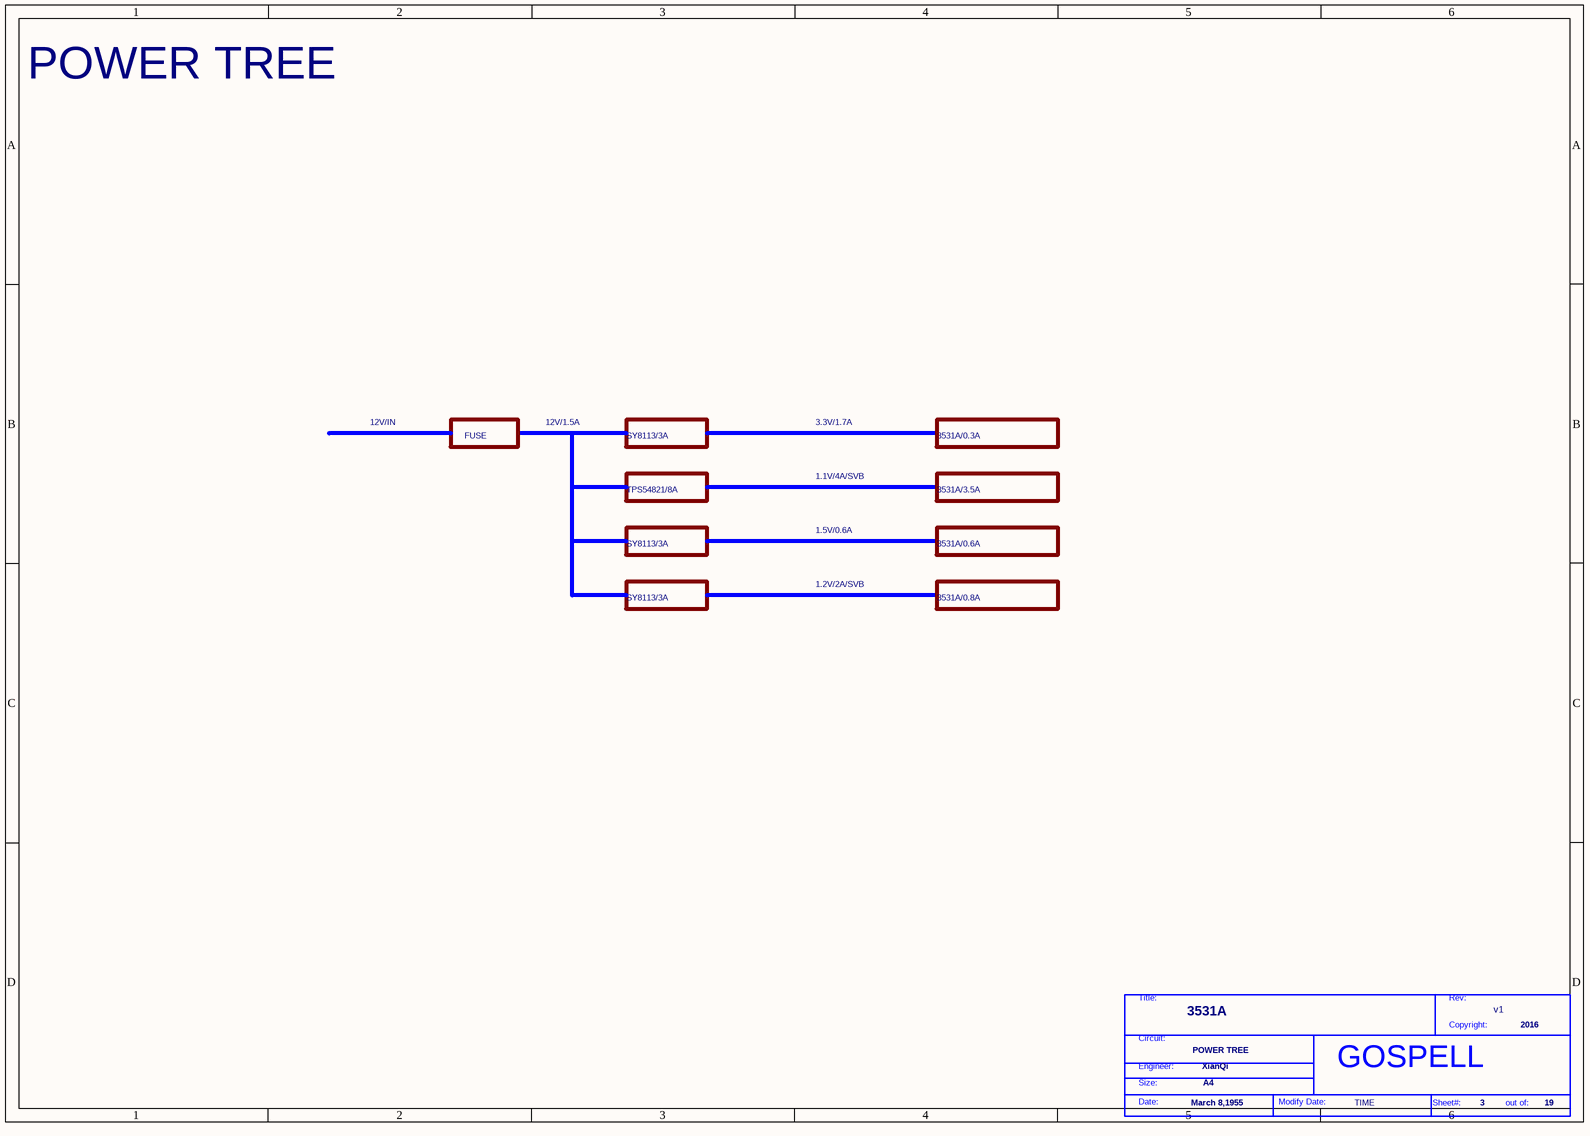
[diagram p15: P03 POWER TREE.SchDoc]

### Parts
(Parts that share a designator on the sheet are numbered #1, #2 ... from top to bottom, then left to right.)
*#16  Page Modify Date: TIME  Engineer: XianQi  Copyright: 2016  Title: 3531A  RevCode: v1  Page Size: A4  Page Create Date: March 8,1955  Page Number: 3  Page Count: 19  Doc: POWER TREE  (hidden comment: GOSPELL)  (graphical)

### Notes on the sheet
- POWER TREE
- 12V/IN
- FUSE
- 12V/1.5A
- SY8113/3A
- 3.3V/1.7A
- 3531A/0.3A
- TPS54821/8A
- 1.5V/0.6A
- 1.1V/4A/SVB
- 3531A/3.5A
- 1.2V/2A/SVB
- 3531A/0.6A
- 3531A/0.8A
- (in symbol GOSPELL) Title:; Rev:; Copyright:; Circuit:; Engineer:; Size:; Date:; Modify Date:; Sheet#:; out of:

## Sheet P02 BLOCK DIAGRAM.SchDoc
size 420 x 297 mm
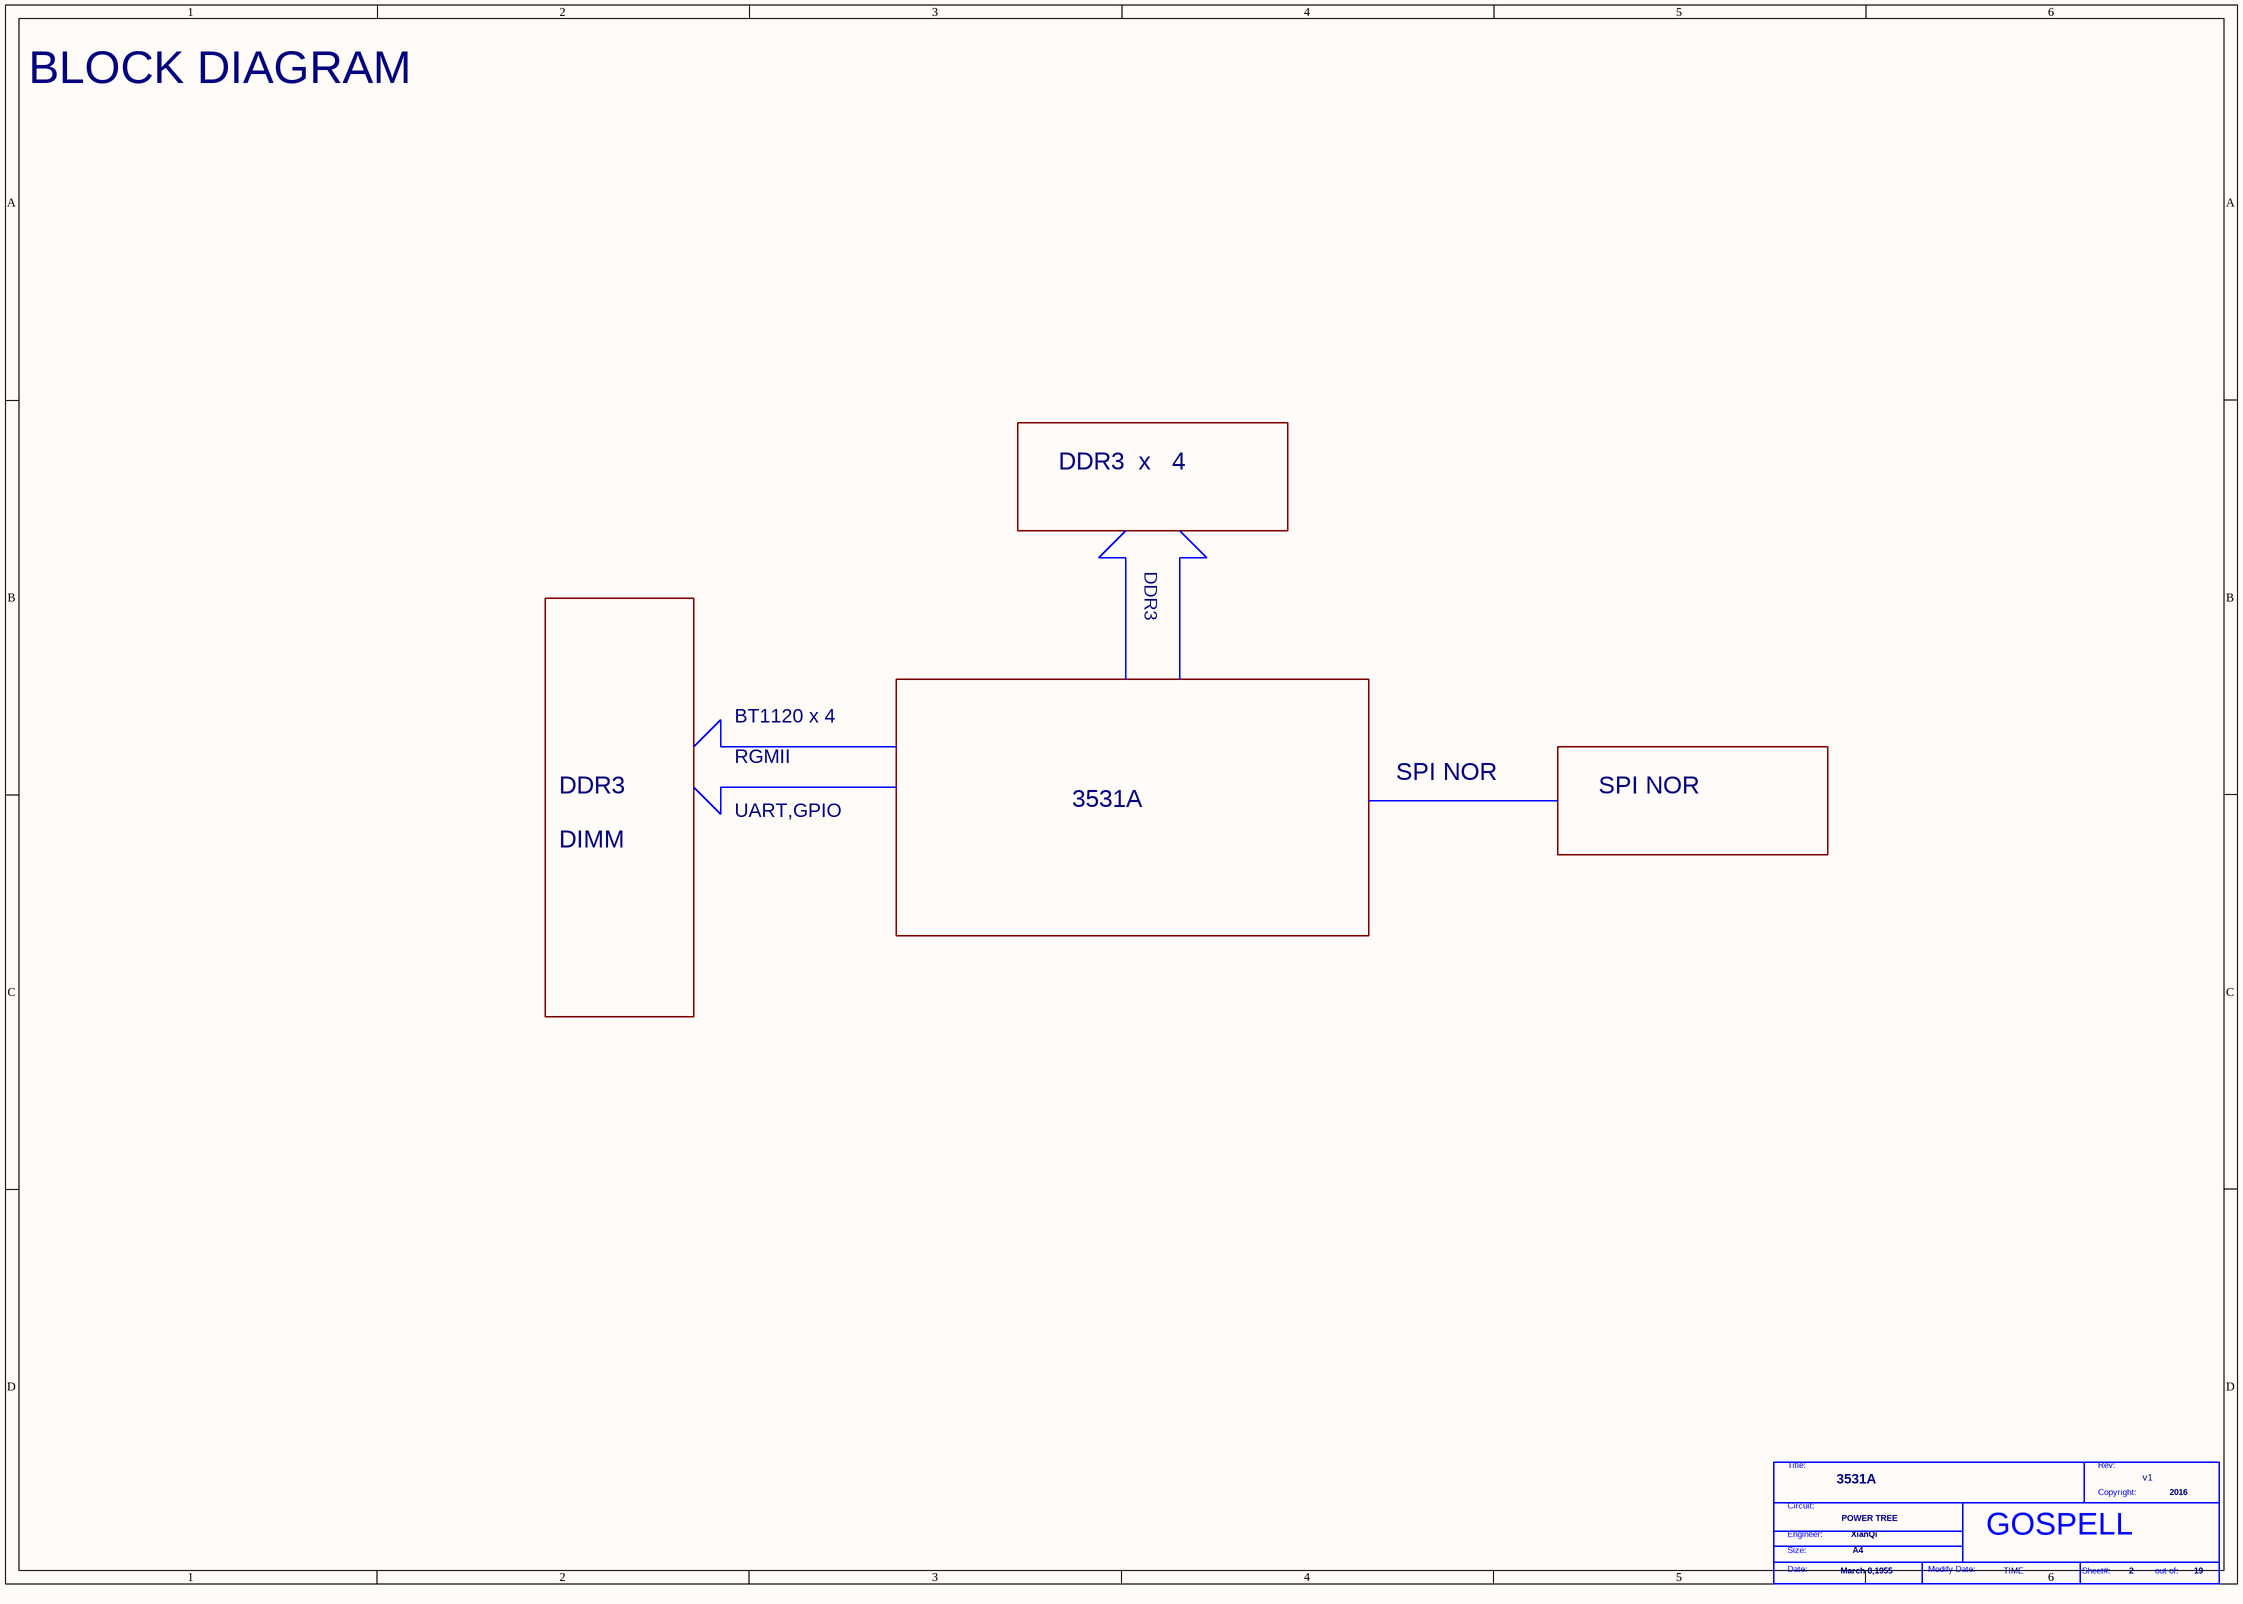
[diagram p16: P02 BLOCK DIAGRAM.SchDoc]

### Parts
(Parts that share a designator on the sheet are numbered #1, #2 ... from top to bottom, then left to right.)
*#17  Page Modify Date: TIME  Engineer: XianQi  Copyright: 2016  Title: 3531A  RevCode: v1  Page Size: A4  Page Create Date: March 8,1955  Page Number: 2  Page Count: 19  Doc: POWER TREE  (hidden comment: GOSPELL)  (graphical)

### Notes on the sheet
- BLOCK DIAGRAM
- DDR3  x   4
- DDR3
- BT1120 x 4
- RGMII
- SPI NOR
- DIMM
- UART,GPIO
- 3531A
- (in symbol GOSPELL) Title:; Rev:; Copyright:; Circuit:; Engineer:; Size:; Date:; Modify Date:; Sheet#:; out of:

## Sheet P01 NOTE $ TITLE.SchDoc
size 297 x 209 mm
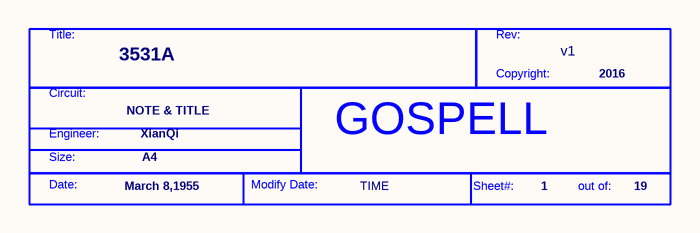
[diagram p17: P01 NOTE $ TITLE.SchDoc]

### Parts
(Parts that share a designator on the sheet are numbered #1, #2 ... from top to bottom, then left to right.)
*#18  Page Modify Date: TIME  Engineer: XianQi  Copyright: 2016  Title: 3531A  RevCode: v1  Page Size: A4  Page Create Date: March 8,1955  Page Number: 1  Page Count: 19  Doc: NOTE & TITLE  (hidden comment: GOSPELL)  (graphical)